# EAGLE design 6Taster_RGB-LED (EAGLE 7.2.0)
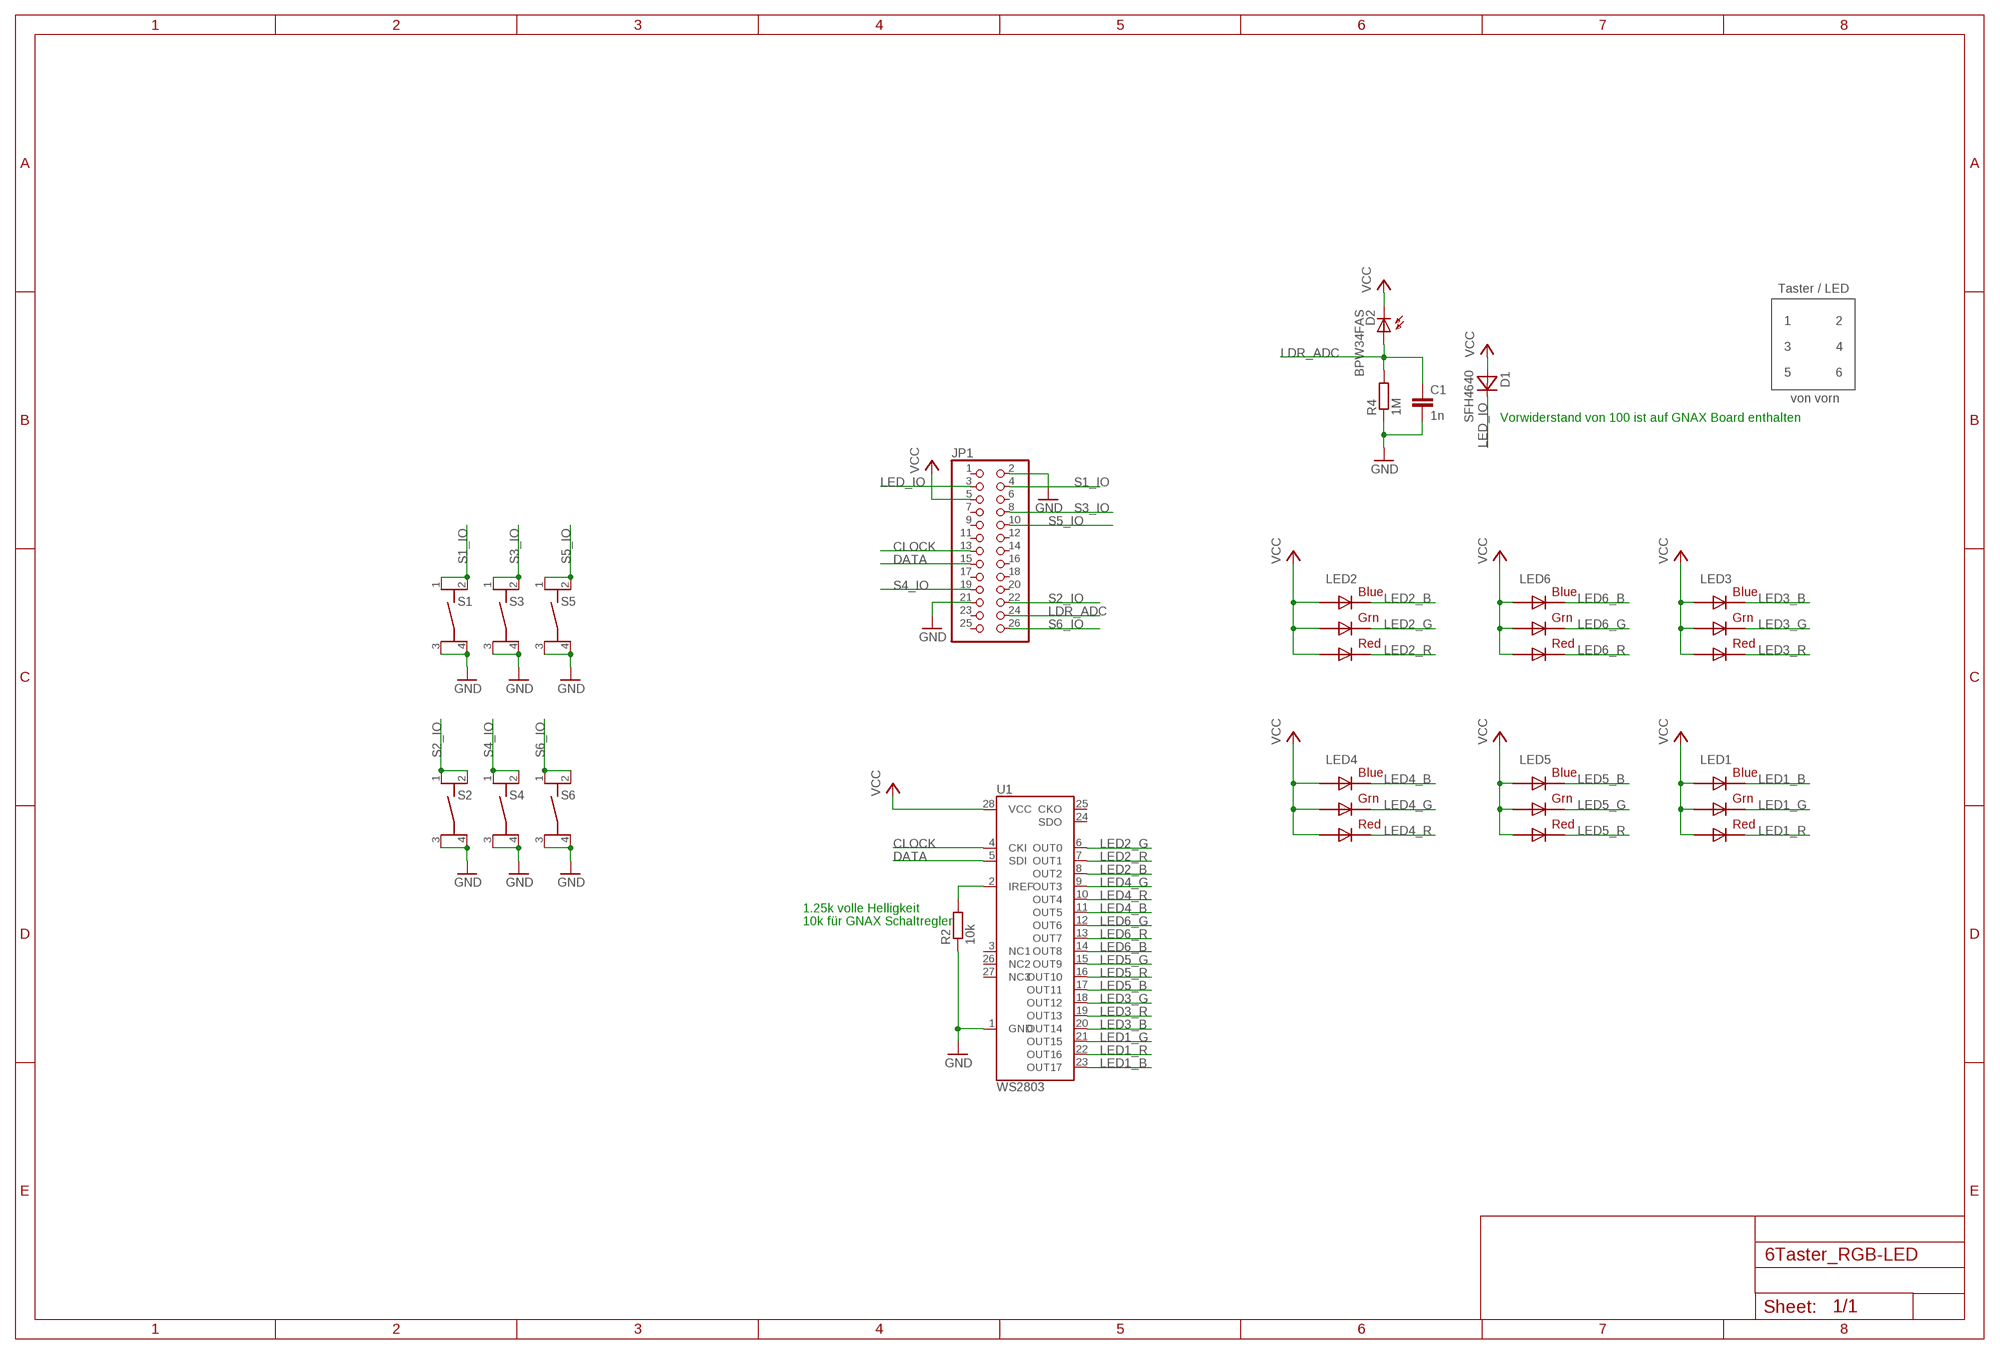
[diagram p0: schematic, sheet 1]

## Parts
C1  1n  C-EUC0805  [C0805]
D1  SFH4640  [SFH4640]
D2  BPW34FAS  [BPW34FAS]
JP1  PINHD-2X13_2.54-SMD  [2X13SMD]
LED1  RGB  RGBLED5050  [RGBLED5050]
LED2  RGB  RGBLED5050  [RGBLED5050]
LED3  RGB  RGBLED5050  [RGBLED5050]
LED4  RGB  RGBLED5050  [RGBLED5050]
LED5  RGB  RGBLED5050  [RGBLED5050]
LED6  RGB  RGBLED5050  [RGBLED5050]
R2  10k  R-EU_R0805  [R0805]
R4  1M  R-EU_R0805  [R0805]
S1  TASTER_9314SMD  [TASTER_9314]
S2  TASTER_9314SMD  [TASTER_9314]
S3  TASTER_9314SMD  [TASTER_9314]
S4  TASTER_9314SMD  [TASTER_9314]
S5  TASTER_9314SMD  [TASTER_9314]
S6  TASTER_9314SMD  [TASTER_9314]
U1  WS2803  [SOP-28]

## Nets
CLOCK: JP1.13 U1.4(CKI)
DATA: JP1.15 U1.5(SDI)
GND: C1.2 JP1.2 JP1.21 R2.1 R4.1 S1.3 S1.4 S2.3 S2.4 S3.3 S3.4 S4.3 S4.4 S5.3 S5.4 S6.3 S6.4 U1.1(GND)
LDR_ADC: C1.1 D2.ANODE(A) JP1.24 R4.2
LED1_B: LED1.4(BLUE_C) U1.23(OUT17)
LED1_G: LED1.6(GREEN_C) U1.21(OUT15)
LED1_R: LED1.5(RED_C) U1.22(OUT16)
LED2_B: LED2.4(BLUE_C) U1.8(OUT2)
LED2_G: LED2.6(GREEN_C) U1.6(OUT0)
LED2_R: LED2.5(RED_C) U1.7(OUT1)
LED3_B: LED3.4(BLUE_C) U1.20(OUT14)
LED3_G: LED3.6(GREEN_C) U1.18(OUT12)
LED3_R: LED3.5(RED_C) U1.19(OUT13)
LED4_B: LED4.4(BLUE_C) U1.11(OUT5)
LED4_G: LED4.6(GREEN_C) U1.9(OUT3)
LED4_R: LED4.5(RED_C) U1.10(OUT4)
LED5_B: LED5.4(BLUE_C) U1.17(OUT11)
LED5_G: LED5.6(GREEN_C) U1.15(OUT9)
LED5_R: LED5.5(RED_C) U1.16(OUT10)
LED6_B: LED6.4(BLUE_C) U1.14(OUT8)
LED6_G: LED6.6(GREEN_C) U1.12(OUT6)
LED6_R: LED6.5(RED_C) U1.13(OUT7)
LED_IO: D1.KATHODE(C) JP1.3
N$1: R2.2 U1.2(IREF)
S1_IO: JP1.4 S1.1 S1.2
S2_IO: JP1.22 S2.1 S2.2
S3_IO: JP1.8 S3.1 S3.2
S4_IO: JP1.19 S4.1 S4.2
S5_IO: JP1.10 S5.1 S5.2
S6_IO: JP1.26 S6.1 S6.2
VCC: D1.ANODE(A) D2.KATHODE(C) JP1.5 LED1.1(GREEN_A) LED1.2(RED_A) LED1.3(BLUE_A) LED2.1(GREEN_A) LED2.2(RED_A) LED2.3(BLUE_A) LED3.1(GREEN_A) LED3.2(RED_A) LED3.3(BLUE_A) LED4.1(GREEN_A) LED4.2(RED_A) LED4.3(BLUE_A) LED5.1(GREEN_A) LED5.2(RED_A) LED5.3(BLUE_A) LED6.1(GREEN_A) LED6.2(RED_A) LED6.3(BLUE_A) U1.28(VCC)
Unconnected: JP1.1 JP1.6 JP1.7 JP1.9 JP1.11 JP1.12 JP1.14 JP1.16 JP1.17 JP1.18 JP1.20 JP1.23 JP1.25 U1.3(NC1) U1.24(SDO) U1.25(CKO) U1.26(NC2) U1.27(NC3)

## Notes on the sheet
- Taster / LED
- 1 | 2
- 3 | 4
- 5 | 6
- von vorn
- Vorwiderstand von 100 ist auf GNAX Board enthalten
- 1.25k volle Helligkeit
- 10k für GNAX Schaltregler

## Library data of the parts
C1 = rcl:C-EU: CAPACITOR, European symbol
D1 = IR_LED_Photodiode_KNX_Taster:SFH4640
D2 = IR_LED_Photodiode_KNX_Taster:BPW34FAS
JP1 = pinhead_uc_forum:PINHD-2X13: PIN HEADER
LED1-LED6 = adafruit:RGBLED: For 5050 RGB LEDs, the order of the LEDs may vary from one manufacturer to another!
R2 R4 = rcl:R-EU_: RESISTOR, European symbol
S1-S6 = switch:TASTER_9314
U1 = WS2803:WS2803: WS2803 18 Channel Constant Current LED Driver with programmable PWM outputs.

## Board
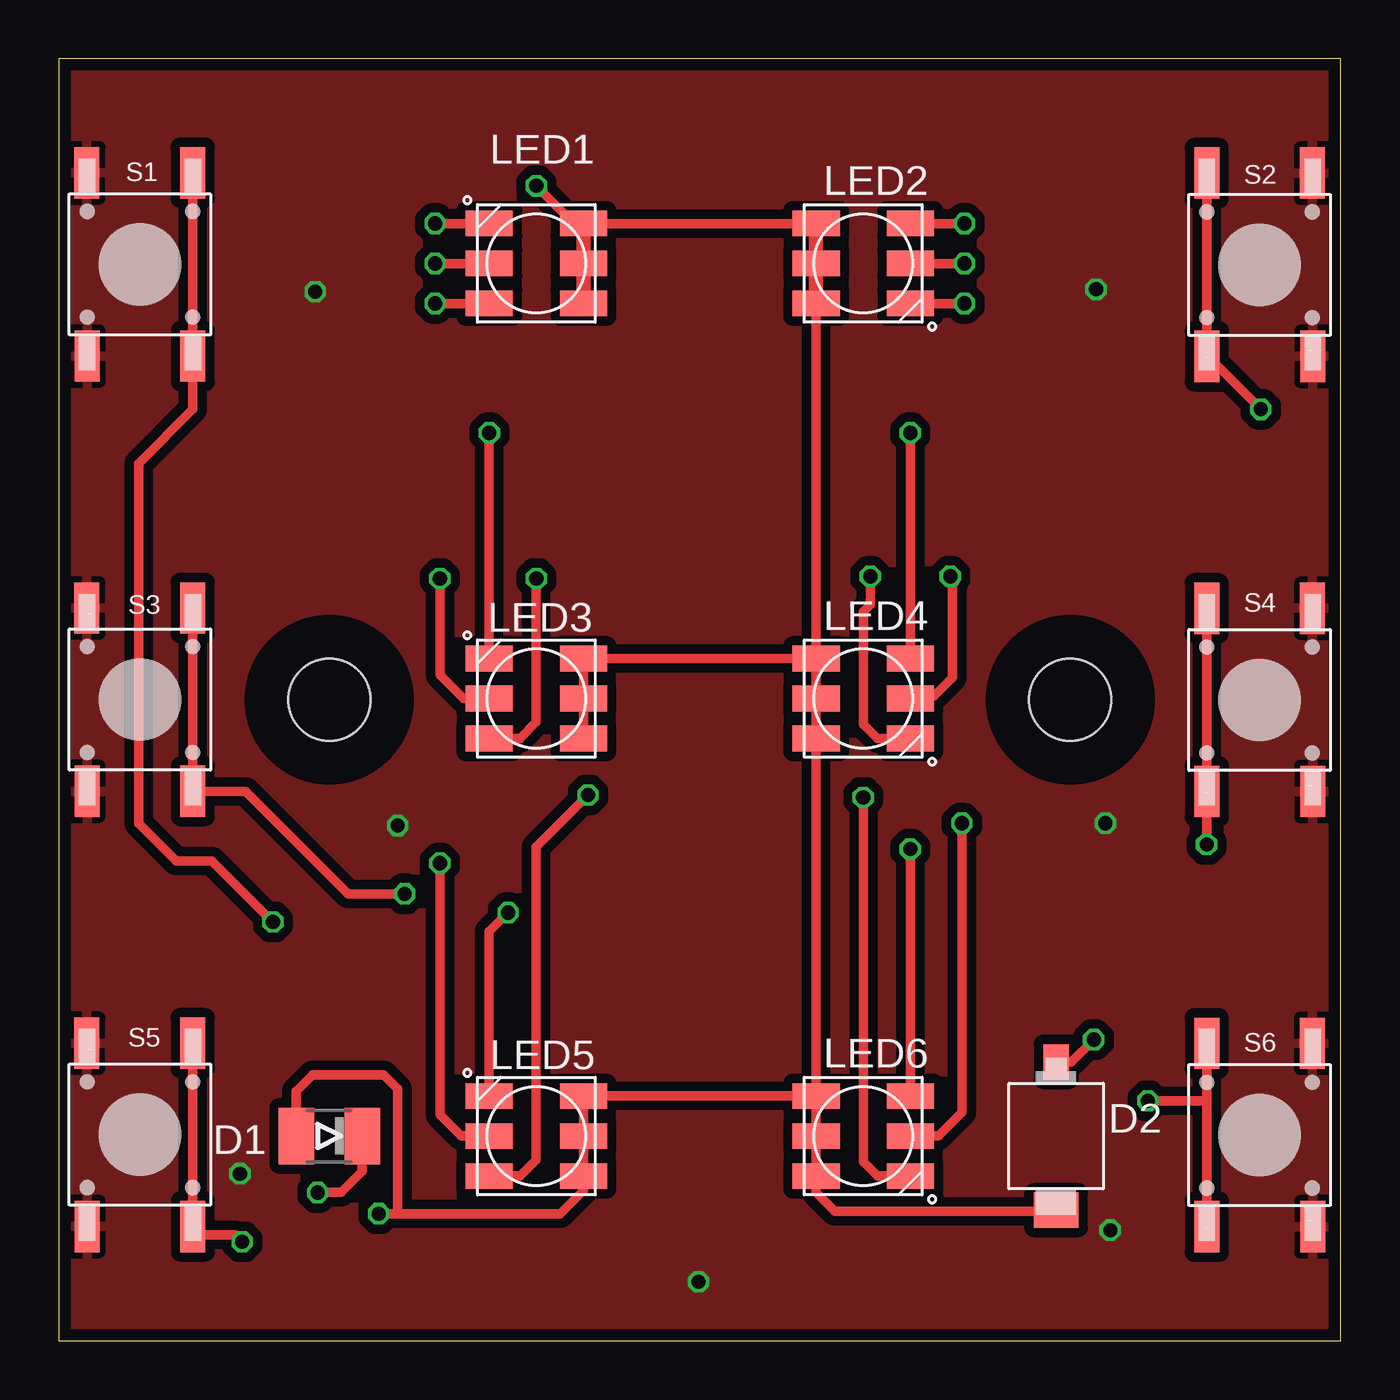
[diagram p1: board, top side]
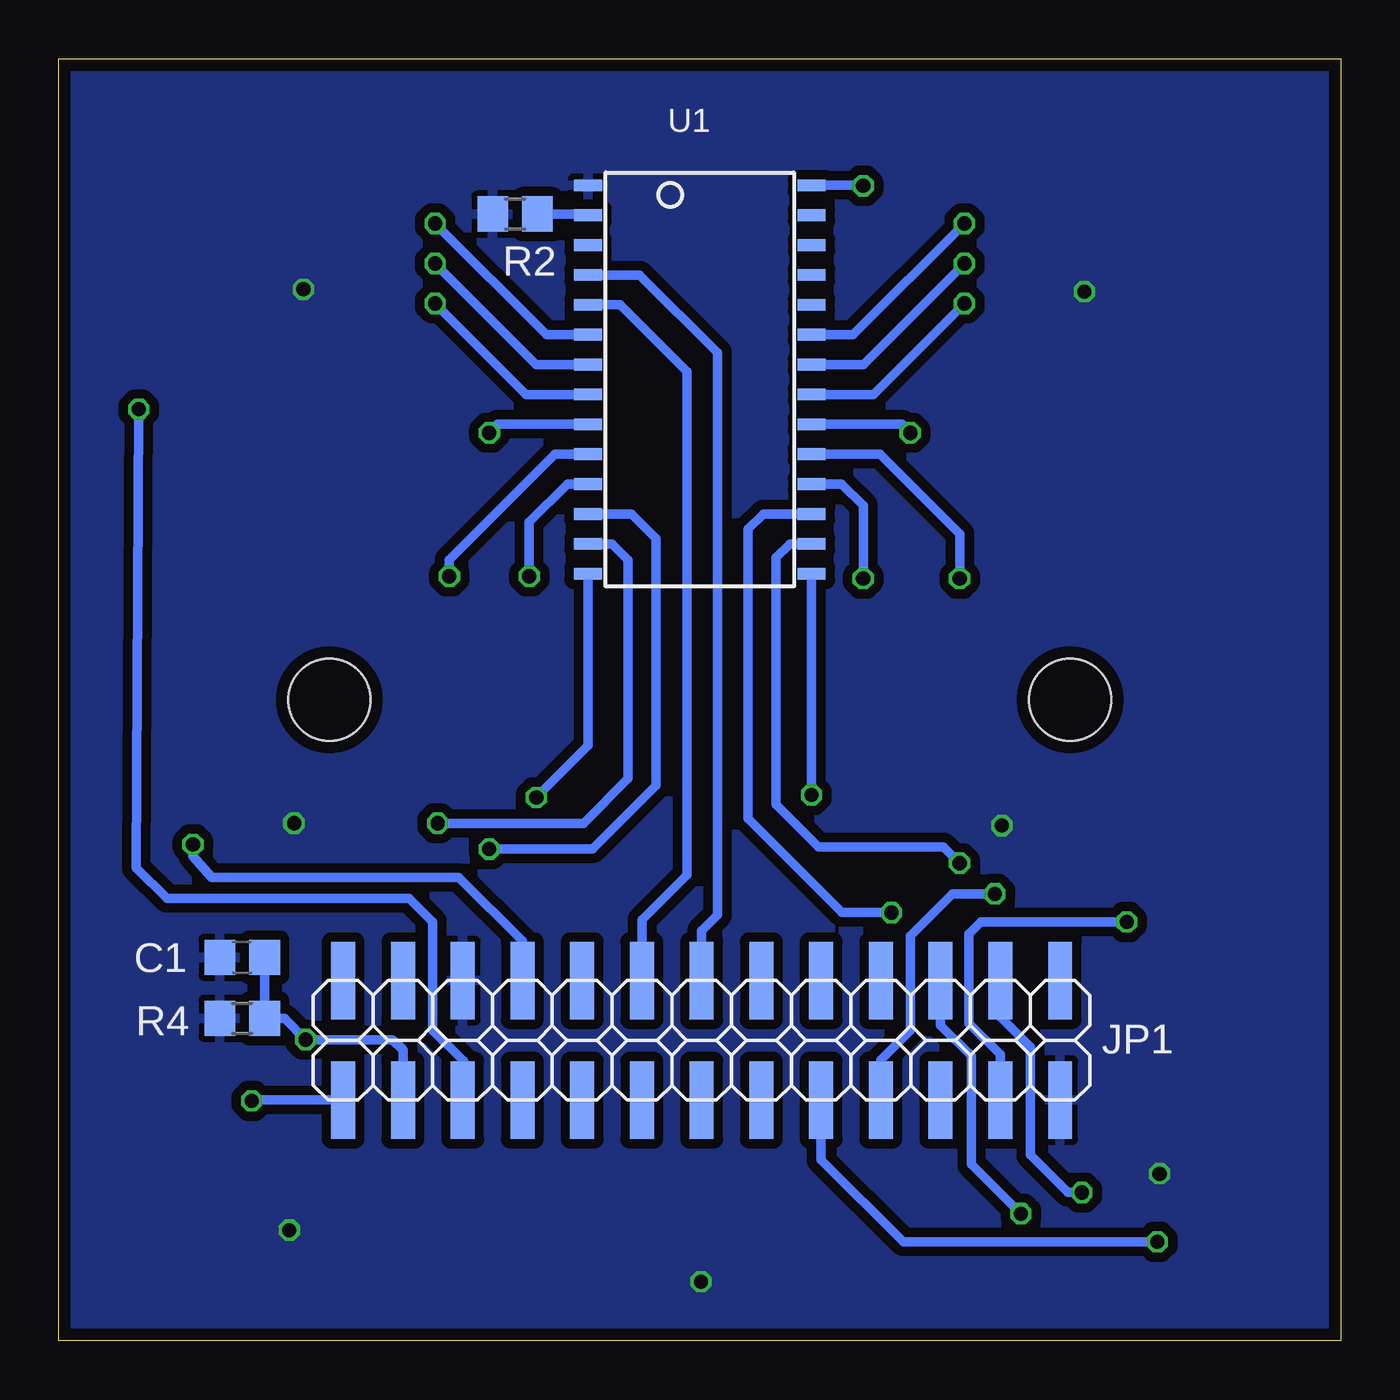
[diagram p2: board, bottom side, seen from below]

Size 54.5 x 54.5 mm. Coordinates in mm from the lower left corner, seen from the top.
Outline: 0,0 54.5,0 54.5,54.5 0,54.5 0,0
Copper layers (1*16): Top 0.035mm / dielectric 1.6mm / Bottom 0.035mm
Design rules "Elecrow_2-layer_PCB_eagle_rule": minimum track width 6mil, minimum drill 12mil, track to track 6mil, track to pad 6mil, pad to pad 6mil, via to via 8mil, smd to smd 0mil, copper to edge 20mil, drill to drill 10mil, minimum pad ring 6mil, minimum via ring 6mil, stop-mask expansion 0mil, vias tented up to drill 100mil, thermal gap 10mil
Holes 3.5 mm at 11.5,27.25 43,27.25
tKeepout: area 0,34.5 to 54.5,38.5; area 0,16 to 54.5,20; area 0,52.5 to 54.5,54.5; area 0,0 to 54.5,2; area 24,0 to 30.5,54.5
bKeepout: area 7.8,23.5 to 15.2,31; area 39.2,23.5 to 46.8,31; area -0.5,-0.5 to 4.5,55.5; area -0.5,50 to 55,55.5; area 50,-0.5 to 55,55.5; area -0.5,-0.5 to 55,4.5; area -0.5,24 to 55,30.5
tRestrict: area 9,24.8 to 14,29.7; area 40.5,24.8 to 45.5,29.7

### Footprints (pad centres in the part's own frame; a part is rotated, then mirrored left to right if it is on the bottom)
C0805 = smd 1.3 x 1.5: 1 -0.95,0; 2 0.95,0
SFH4640 = smd 1.5 x 2.4: ANODE 1.4,0; KATHODE -1.4,0
BPW34FAS = smd 1.5 x 1.1: ANODE -3.15,0 | smd 1.5 x 1.9: KATHODE 3.15,0
2X13SMD = smd 1.016 x 3.302: 1 -1.27,-3.81; 2 -1.27,1.27; 3 1.27,-3.81; 4 1.27,1.27; 5 3.81,-3.81; 6 3.81,1.27; 7 6.35,-3.81; 8 6.35,1.27; 9 8.89,-3.81; 10 8.89,1.27; 11 11.43,-3.81; 12 11.43,1.27; 13 13.97,-3.81; 14 13.97,1.27; 15 16.51,-3.81; 16 16.51,1.27; 17 19.05,-3.81; 18 19.05,1.27; 19 21.59,-3.81; 20 21.59,1.27; 21 24.13,-3.81; 22 24.13,1.27; 23 26.67,-3.81; 24 26.67,1.27; 25 29.21,-3.81; 26 29.21,1.27
RGBLED5050 = smd 2 x 1.1: 1 -2,1.7; 2 -2,0; 3 -2,-1.7; 4 2,-1.7; 5 2,0; 6 2,1.7
R0805 = smd 1.3 x 1.5: 1 -0.95,0; 2 0.95,0
TASTER_9314 = smd 2.184 x 1.067: 1 -3.9,2.29; 2 3.89,2.3; 3 -3.9,-2.21; 4 3.89,-2.2
SOP-28 = smd 0.5 x 1.2: 1 -7.62,-4.5; 2 -6.35,-4.5; 3 -5.08,-4.5; 4 -3.81,-4.5; 5 -2.54,-4.5; 6 -1.27,-4.5; 7 0,-4.5; 8 1.27,-4.5; 9 2.54,-4.5; 10 3.81,-4.5; 11 5.08,-4.5; 12 6.35,-4.5; 13 7.62,-4.5; 14 8.89,-4.5; 15 8.89,5; 16 7.62,5; 17 6.35,5; 18 5.08,5; 19 3.81,5; 20 2.54,5; 21 1.27,5; 22 0,5; 23 -1.27,5; 24 -2.54,5; 25 -3.81,5; 26 -5.08,5; 27 -6.35,5; 28 -7.62,5

### Placement (x,y rotation side)
C1  46.7,16.3 180 bottom
D1  11.5,8.7 180 top
D2  42.4,8.7 270 top
JP1  13.2,11.5 180 bottom
LED1  20.3,45.8 180 top
LED2  34.2,45.8 0 top
LED3  20.3,27.3 180 top
LED4  34.2,27.3 0 top
LED5  20.3,8.7 180 top
LED6  34.2,8.7 0 top
R2  35.1,47.9 0 bottom
R4  46.7,13.7 0 bottom
S1  3.4,45.75 270 top
S2  51.1,45.75 90 top
S3  3.4,27.25 270 top
S4  51.1,27.25 90 top
S5  3.4,8.75 270 top
S6  51.1,8.75 90 top
U1  27.5,41.5 270 bottom

### Tracks (layer width: path | path; a pad name or v marks a point on that pad's centre or on a via)
CLOCK
  Bottom 0.406: U1.4 29.81,45.31 26.5,42 26.5,18.1 27.17,17.43 JP1.13
DATA
  Bottom 0.406: U1.5 30.64,44.04 27.8,41.2 27.8,19.8 29.7,17.9 JP1.15
GND  (via drill 0.6)
  other vias: 44.5,22 27.2,2.5 14.4,21.9 10.9,44.6 44.1,44.7 7.7,7.1 44.7,4.7
  pour Bottom (isolate 0.406): 0,0 0,54.5 54.4,54.5 54.5,54.5 54.5,0
  pour Top (isolate 0.406): 0.1,0 0.1,54.5 54.4,54.5 54.5,54.5 54.5,0
LDR_ADC  (via drill 0.6)
  Top 0.406: D2.ANODE 43.05,11.85 v44,12.8
  Bottom 0.406: C1.1 R4.2 44.9,13.7 v44,12.8 40.3,12.8 39.87,12.37 JP1.24
LED1_B  (via drill 0.6)
  Top 0.406: LED1.4 v16,47.5
  Bottom 0.406: U1.23 20.73,42.77 v16,47.5
LED1_G  (via drill 0.6)
  Top 0.406: v16,44.1 LED1.6
  Top 0.61: LED1.6 17.7,44.1
  Bottom 0.406: U1.21 19.87,40.23 v16,44.1
LED1_R  (via drill 0.6)
  Top 0.406: v16,45.8 LED1.5
  Bottom 0.406: U1.22 20.3,41.5 v16,45.8
LED2_B  (via drill 0.6)
  Top 0.406: v38.5,44.1 LED2.4
  Bottom 0.406: U1.8 34.63,40.23 v38.5,44.1
LED2_G  (via drill 0.6)
  Top 0.406: LED2.6 v38.5,47.5
  Bottom 0.406: U1.6 33.77,42.77 v38.5,47.5
LED2_R  (via drill 0.6)
  Top 0.406: v38.5,45.8 LED2.5
  Bottom 0.406: U1.7 34.2,41.5 v38.5,45.8
LED3_B  (via drill 0.6)
  Top 0.406: v18.3,38.6 LED3.4
  Bottom 0.406: U1.20 18.66,38.96 v18.3,38.6
LED3_G  (via drill 0.6)
  Top 0.406: LED3.6 19.6,25.6 20.3,26.3 v20.3,32.4
  Bottom 0.406: U1.18 21.22,36.42 20.3,35.5 v20.3,32.4
LED3_R  (via drill 0.6)
  Top 0.406: LED3.5 17.2,27.3 16.2,28.3 v16.2,32.4
  Bottom 0.406: U1.19 19.59,37.69 16.2,34.3 v16.2,32.4
LED4_B  (via drill 0.6)
  Top 0.406: LED4.4 34.8,25.6 34.2,26.2 34.2,31 34.5,31.3 v34.5,32.5
  Bottom 0.406: U1.11 32.88,36.42 34.5,34.8 v34.5,32.5
LED4_G  (via drill 0.6)
  Top 0.406: LED4.6 v36.2,38.6
  Bottom 0.406: U1.9 35.84,38.96 v36.2,38.6
LED4_R  (via drill 0.6)
  Top 0.406: LED4.5 37.2,27.4 38,28.2 38,32.3
  Top 0.61: 38,32.3 v37.9,32.5
  Bottom 0.406: U1.10 33.41,37.69 37.9,33.2 v37.9,32.5
LED5_B  (via drill 0.6)
  Top 0.406: LED5.4 18.3,17.4 v19.1,18.2
  Bottom 0.406: U1.17 24.55,35.15 25.2,34.5 25.2,22.2 21.2,18.2 v19.1,18.2
LED5_G  (via drill 0.6)
  Top 0.406: LED5.6 19.6,7 20.3,7.7 20.3,21 v22.5,23.2
  Bottom 0.406: U1.15 v22.5,23.2
LED5_R  (via drill 0.6)
  Top 0.406: LED5.5 17.1,8.7 16.2,9.6 v16.2,20.3
  Bottom 0.406: U1.16 23.42,33.88 24,33.3 24,22.8 22.2,21 16.9,21 v16.2,20.3
LED6_B  (via drill 0.6)
  Top 0.406: LED6.4 34.8,7 34.2,7.6 v34.2,23.1
  Bottom 0.406: U1.14 32,25.3 v34.2,23.1
LED6_G  (via drill 0.6)
  Top 0.406: v36.2,20.9 LED6.6
  Bottom 0.406: U1.12 30.15,35.15 29.1,34.1 29.1,23.6 31.8,20.9 v36.2,20.9
LED6_R  (via drill 0.6)
  Top 0.406: LED6.5 37.4,8.7 38.4,9.7 v38.4,22
  Bottom 0.406: U1.13 30.98,33.88 30.3,33.2 30.3,23.9 32.2,22 v38.4,22
LED_IO  (via drill 0.6)
  Top 0.406: D1.KATHODE 12.9,7.2 12,6.3 v11,6.3
  Bottom 0.406: JP1.3 14.47,13.77 13.2,12.5 13.2,7.9 11.6,6.3 v11,6.3
N$1
  Bottom 0.406: R2.2 32.05,47.9 U1.2
S1_IO  (via drill 0.6)
  Top 0.406: S1.1 S1.2 5.7,39.6 3.4,37.3 3.4,22 5,20.4 6.5,20.4 v9.1,17.8
  Bottom 0.406: JP1.4 14.47,12.17 15.8,13.5 15.8,17.3 15.3,17.8 v9.1,17.8
S2_IO  (via drill 0.6)
  Top 0.406: 48.91,41.79 v51.1,39.6 | S2.2 S2.1
  Top 0.61: S2.1 48.81,41.79 48.91,41.79
  Bottom 0.406: v51.1,39.6 51.2,20.1 49.9,18.8 39.6,18.8 38.6,17.8 38.6,13.2 37.3,11.9 37.3,10.26 JP1.22
S3_IO  (via drill 0.6)
  Top 0.406: S3.1 S3.2 7.94,23.36 12.3,19 v14.7,19
  Bottom 0.406: JP1.8 19.55,11.95 18.3,13.2 18.3,17.2 16.5,19 v14.7,19
S4_IO  (via drill 0.6)
  Top 0.406: v48.8,21.1 v48.81,21.11 S4.1 S4.2
  Bottom 0.406: v48.8,21.1 48.8,20.6 48,19.7 37.5,19.7 34.79,16.99 JP1.19
S5_IO  (via drill 0.6)
  Top 0.406: 5.7,4.5 7.5,4.5 v7.8,4.2 | S5.1 S5.2
  Top 0.61: 5.5,4.6 5.7,4.6 S5.2 5.7,4.5
  Bottom 0.406: v7.8,4.2 18.6,4.2 22.09,7.69 JP1.10
S6_IO  (via drill 0.6)
  Top 0.406: S6.2 48.8,10.2 | 48.8,10.2 S6.1 | v46.3,10.2 48.8,10.2
  Bottom 0.406: JP1.26 46.17,10.23 v46.3,10.2
VCC  (via drill 0.6)
  Top 0.406: LED4.1 LED4.2 LED4.3 LED6.1 | LED3.1 LED3.2 LED3.3 LED4.1 | 21.9,47.5 v20.3,49.1 | LED1.3 LED2.1 | LED2.3 LED4.1 | LED6.1 LED5.3 LED5.2 LED5.1 22.3,6.4 21.3,5.4 14.4,5.4 | LED6.1 LED6.2 LED6.3 | 32.1,6.9 LED6.3 | v13.6,5.4 14.4,5.4 | D1.ANODE 10.1,10.6 10.8,11.3 13.8,11.3 14.4,10.7 14.4,5.4 | LED6.3 32.2,6.3 33,5.5 42.35,5.5 D2.KATHODE
  Top 0.61: LED2.1 LED2.2 LED2.3 | LED1.1 LED1.2 LED1.3 21.9,47.5
  Bottom 0.406: U1.28 20.32,49.12 v20.3,49.1 | JP1.5 17.01,13.41 15.7,12.1 15.7,7.5 v13.6,5.4

### Text on the board
tDocu: TOP
bDocu: BOTTOM